# Altium schematic sheet MAIN.SchDoc
size A2; SheetNumber: 1; SheetTotal: 1
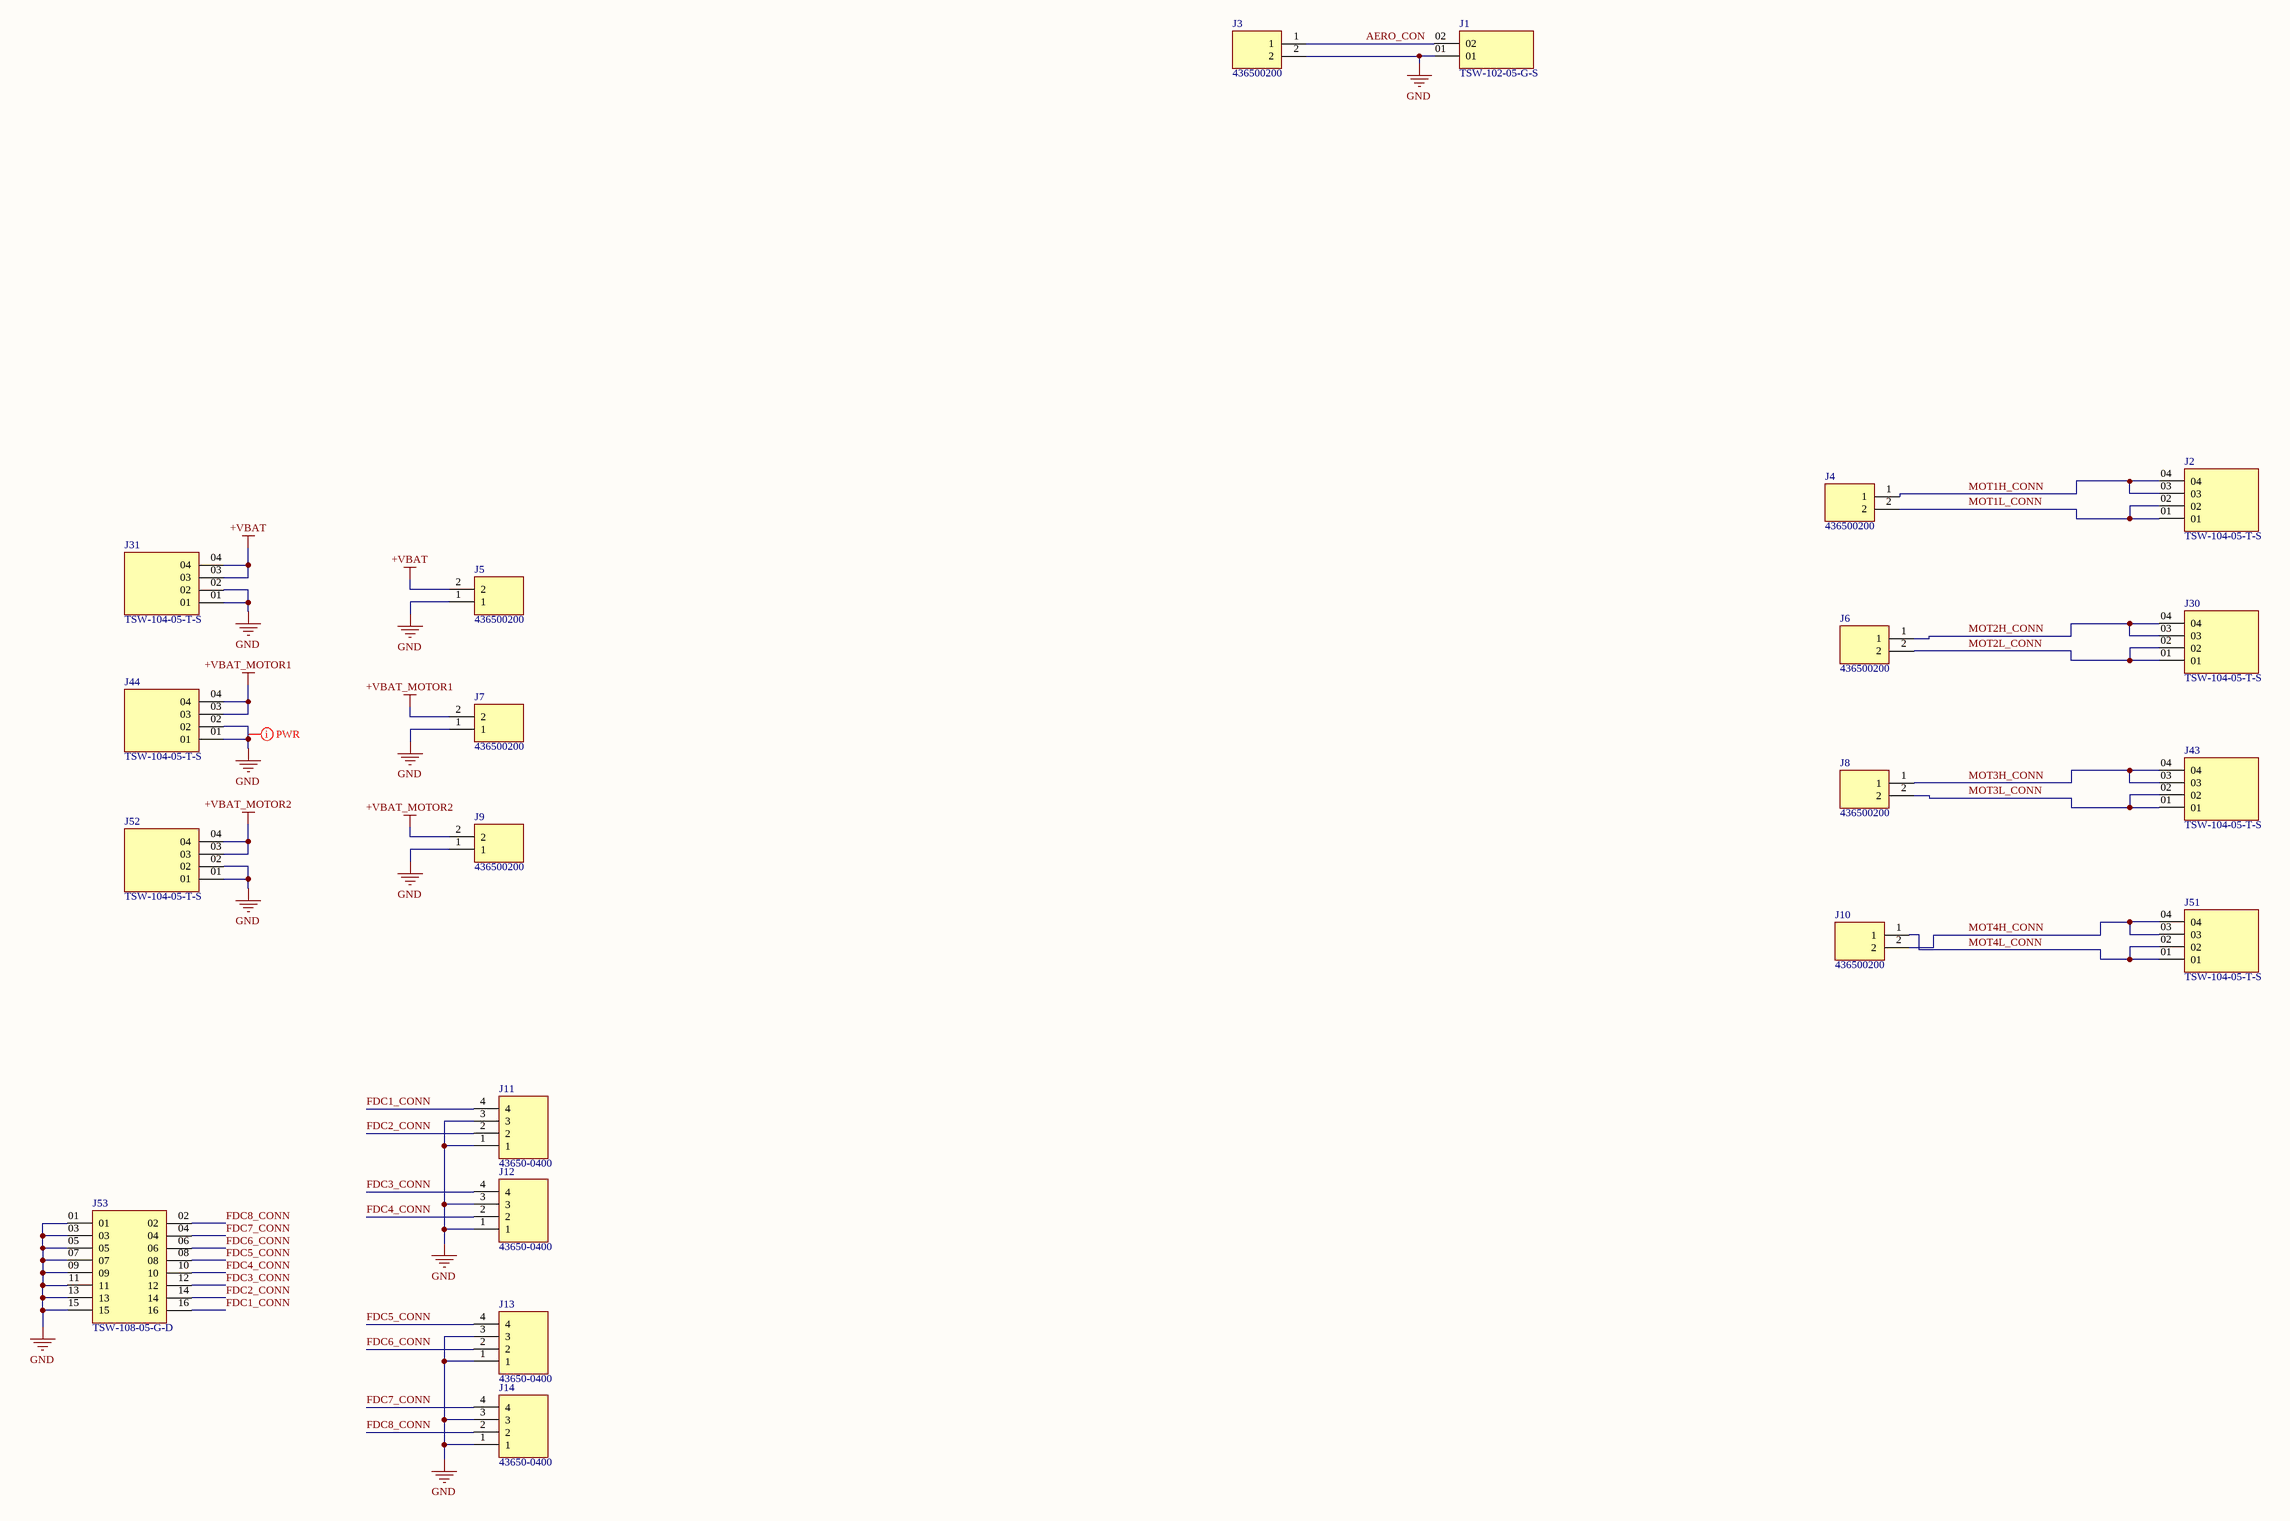
[diagram p0: MAIN.SchDoc]

## Parts
J1  TSW-102-05-G-S  [SAMTEC_TSW-102-05-G-S]
J2  TSW-104-05-T-S  [SAMTEC_TSW-104-05-T-S]
J3  436500200  [4365002YY_4]
J4  436500200  [4365002YY_4]
J5  436500200  [4365002YY_4]
J6  436500200  [4365002YY_4]
J7  436500200  [4365002YY_4]
J8  436500200  [4365002YY_4]
J9  436500200  [4365002YY_4]
J10  436500200  [4365002YY_4]
J11  43650-0400  [43650-04YY_R]
J12  43650-0400  [43650-04YY_R]
J13  43650-0400  [43650-04YY_R]
J14  43650-0400  [43650-04YY_R]
J30  TSW-104-05-T-S  [SAMTEC_TSW-104-05-T-S]
J31  TSW-104-05-T-S  [SAMTEC_TSW-104-05-T-S]
J43  TSW-104-05-T-S  [SAMTEC_TSW-104-05-T-S]
J44  TSW-104-05-T-S  [SAMTEC_TSW-104-05-T-S]
J51  TSW-104-05-T-S  [SAMTEC_TSW-104-05-T-S]
J52  TSW-104-05-T-S  [SAMTEC_TSW-104-05-T-S]
J53  TSW-108-05-G-D  [SAMTEC_TSW-108-05-G-D]

## Nets
+VBAT: J5.2 J31.03 J31.04
+VBAT_MOTOR1: J7.2 J44.03 J44.04
+VBAT_MOTOR2: J9.2 J52.03 J52.04
GND: J1.01 J3.2 J5.1 J7.1 J9.1 J11.1 J11.3 J12.1 J12.3 J13.1 J13.3 J14.1 J14.3 J31.01 J31.02 J44.01 J44.02 J52.01 J52.02 J53.01 J53.03 J53.05 J53.07 J53.09 J53.11 J53.13 J53.15
AERO_CON: J1.02 J3.1
FDC1_CONN: J11.4 J53.16
FDC2_CONN: J11.2 J53.14
FDC3_CONN: J12.4 J53.12
FDC4_CONN: J12.2 J53.10
FDC5_CONN: J13.4 J53.08
FDC6_CONN: J13.2 J53.06
FDC7_CONN: J14.4 J53.04
FDC8_CONN: J14.2 J53.02
MOT1H_CONN: J2.03 J2.04 J4.1
MOT1L_CONN: J2.01 J2.02 J4.2
MOT2H_CONN: J6.1 J30.03 J30.04
MOT2L_CONN: J6.2 J30.01 J30.02
MOT3H_CONN: J8.1 J43.03 J43.04
MOT3L_CONN: J8.2 J43.01 J43.02
MOT4H_CONN: J10.2 J51.03 J51.04
MOT4L_CONN: J10.1 J51.01 J51.02

## Layout directives
net class PWR: GND

## Library data of the parts
J1 = TSW-102-05-G-S: MF: {'manufacturer': u'Samtec Inc.'}; MP: TSW-102-05-G-S; Price: None; Package: None; Value: *; Availability: Unavailable
J2 J30 J31 J43 J44 J51 J52 = TSW-104-05-T-S: MF: {'manufacturer': u'Samtec'}; MP: TSW-104-05-T-S; Price: None; Package: None; Value: *; Availability: Unavailable
J3-J10 = 436500200: Connector; Manufacturer_Name: Molex; Datasheet Link: https://www.molex.com/pdm_docs/sd/436500200_sd.pdf; Height: 13.56mm; Manufacturer_Part_Number: 436500200
J11-J14 = 43650-0400: Connector; Manufacturer_Name: Molex; Datasheet Link: https://www.molex.com/pdm_docs/sd/436500200_sd.pdf; Height: 5.57mm; Manufacturer_Part_Number: 43650-0400; Mouser Part Number: 538-43650-0400; Mouser Price/Stock: https://www.mouser.co.uk/ProductDetail/Molex/43650-0400?qs=A%252B%2FNCR0PvNV09lp6LzdRYg%3D%3D
J53 = TSW-108-05-G-D: MF: {'manufacturer': u'Samtec'}; MP: TSW-108-05-G-D; Price: None; Package: None; Value: *; Availability: Unavailable